# Altium project PWM Controller.PrjPcb
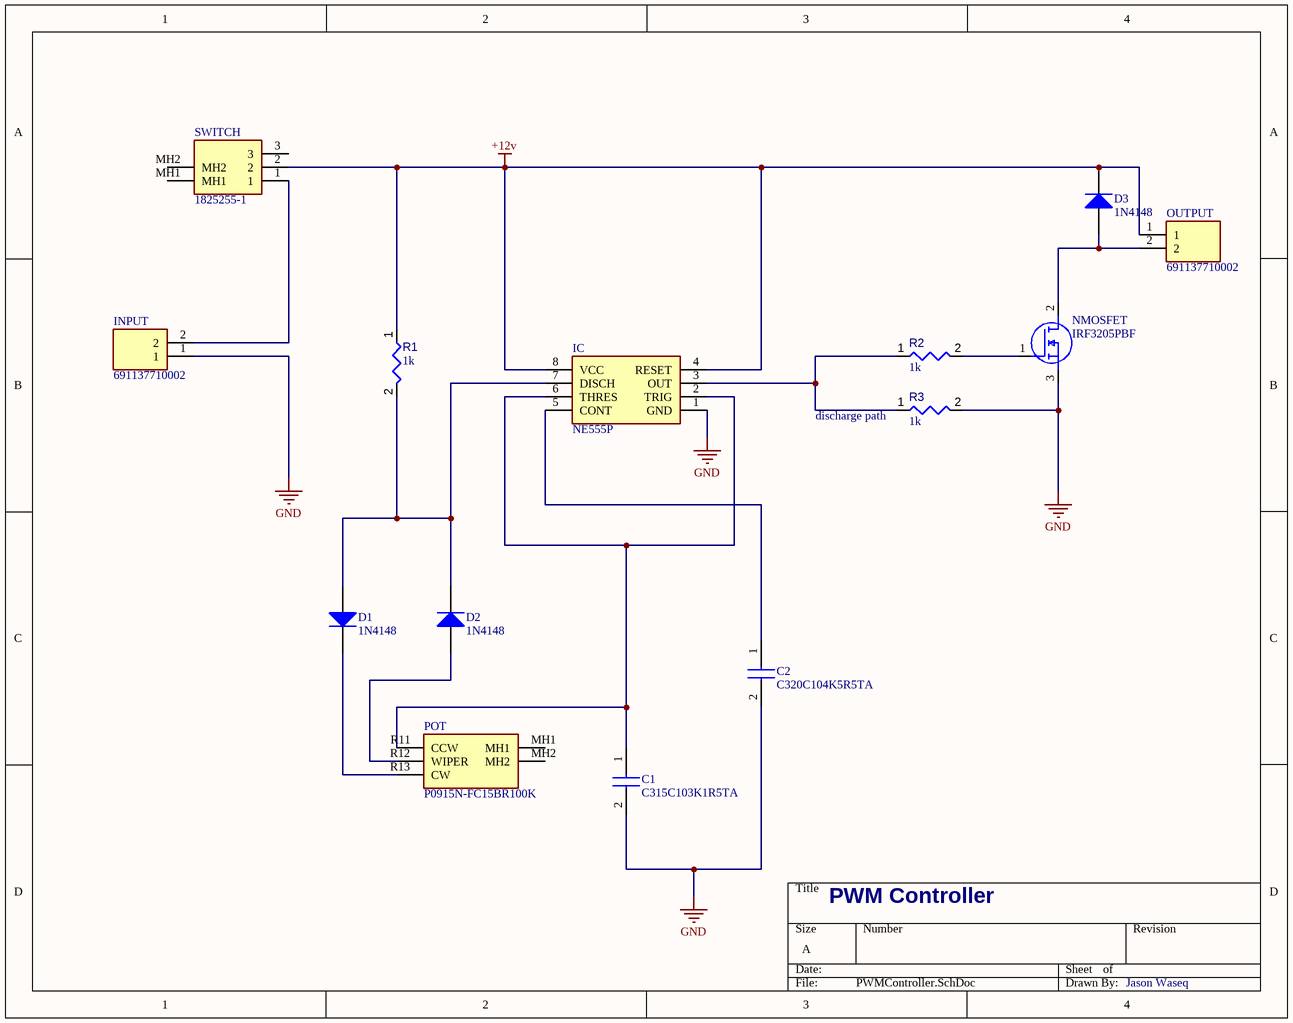
[diagram p0: PWMController.SchDoc]
1 sheet, 14 parts. Net scope: global (net labels, ports and power ports of the same name join across sheets).
Board file: PWMController.PcbDoc

## Sheet PWMController.SchDoc
size A; SheetNumber: 1; SheetTotal: 1; SPICEModelCacheWEVZOAQU: <root> / <DocumentId>WEVZOAQU</DocumentId> / <CacheFrame Number="0"> / <Model Name="555" Kind="CKT"> / <Text>*555 / *Nodes:       GND TRIG OUT RESET CVOLT THOLD DISCHG VCC / .SUBCKT 555    1   2    3    4     5     6     7     8 / EREF 15 1 8 1 .5 / GSOURCE 8 3 8 26 12.5E-3 / GSINK 3 1 26 1 67E-3 / VD1 8 27 DC .8 / VD2 28 1 DC .85 / VREF 30 1 DC 1.2 / C1 29 1 700E-15 / RREF2 30 1 100E3 / RREF 15 1 100E3 / ROUT 3 1 100K / R1 6 1 500E9 / R2 2 1 500E9 / R3 8 5 75E3 / R4 5 9 75E3 / R5 9 1 75E3 / R6 10 11 1E3 / R7 13 14 1E3 / R8 8 12 150E3 / R9 4 8 500E9 / R10 20 19 1E3 / R11 16 17 1E3 / R12 8 18 150E3 / R13 8 21 150E3 / R14 22 23 1E3 / R15 8 26 150E3 / R16 24 25 1E3 / R19 7 1 500E9 / R20 29 26 1E6 / D1 1 11 DMOD / D2 12 11 DMOD / D3 12 14 DMOD / D4 1 14 DMOD / D5 18 17 DMOD / D6 1 17 DMOD / D7 18 19 DMOD / D8 1 19 DMOD / D9 21 14 DMOD / D10 21 25 DMOD / D11 1 23 DMOD / D12 18 23 DMOD / D13 26 25 DMOD / D14 1 25 DMOD1 / D15 3 27 DMOD / D16 28 3 DMOD / E1 10 1 6 5 1000 / E2 13 1 2 9 1000 / E3 16 1 15 12 1000 / E4 22 1 15 21 1000 / E5 24 1 15 18 1000 / E7 20 1 4 30 1000 / M1 7 29 1 1 MOSMOD / .MODEL MOSMOD NMOS (LEVEL=1 KP=1 VTO=1 RD=5) / .MODEL DMOD D (RS=1E-6) / .MODEL DMOD1 D (RS=1E-6 IS=1E-9) / .ENDS 555</Text> / </Model> / <Model Name="nmosfet_level1" Kind="MDL"> / <Text>*----------------------------------------------------------------------------------------------------------------------- / *MOSFETs / *--------------------------------------------------------------------------------------------------------------------- / *MOS1 Shichman and Hodges Models / .model NMOSFET_Level1 nmos (Level=1) </Text> / </Model> / <Model Name="pot" Kind="CKT"> / <Text>*------------------------------------------------------------------------------------------------------------------------- / * potentiometer position must be between 0 and 1 / .SUBCKT POT in out pos params: value=1k  position=0.5 / r1 in pos {value*position} / r2 pos out {value*(1.0-position)} / .ENDS</Text> / </Model> / <Model Name="spst_switch" Kind="CKT"> / <Text>*------------------------- / *SPST Sw Button / * state: if closed&gt;0 - closed else open / * Rclosed -  Closed state resistance / * Ropen -  Open state resistance (Ropen/Rclosed &lt; 1E10) / .SUBCKT  SPST_Switch node1  node2  PARAMS: / + closed=0 / + Rclosed=1m / + Ropen=1Meg / B1 int1 0 V={if(closed&gt;0,1,0)} / S1 node1 node2 int1 0 Smod / .model Smod Vswitch(Ron={Rclosed} Roff={Ropen}) / .ends</Text> / </Model> / </CacheFrame> / </root>

### Parts
C1  C315C103K1R5TA  [C315C103K1R5TA]
C2  C320C104K5R5TA  [C320C104K5R5TA]
D1  1N4148  [NXP-SOD27-2_V]
D2  1N4148  [NXP-SOD27-2_V]
D3  1N4148  [NXP-SOD27-2_V]
IC  NE555P  [DIP794W53P254L959H508Q8N]
INPUT  691137710002  [SHDR2W70P0X500_1X2_1000X750X1160P]
NMOSFET  IRF3205PBF  [TO254P483X1016X1994-3P]
OUTPUT  691137710002  [SHDR2W70P0X500_1X2_1000X750X1160P]
POT  P0915N-FC15BR100K  [P0915NFC15BR100K]
R1  value 1k  [RESA60-630X240]  (hidden comment: MFR-25FBF52-1K)
R2  value 1k  [RESA60-630X240]  (hidden comment: MFR-25FBF52-1K)
R3  value 1k  [RESA60-630X240]  (hidden comment: MFR-25FBF52-1K)
SWITCH  1825255-1  [18252551]

### Nets
+12v: D3.2(K) IC.4(RESET) IC.8(VCC) OUTPUT.1 R1.1 SWITCH.2
GND: C1.2 C2.2 IC.1(GND) INPUT.1 NMOSFET.3(S) R3.2
NetC1_1: C1.1 IC.2(TRIG) IC.6(THRES) POT.R11(CCW)
NetC2_1: C2.1 IC.5(CONT)
NetD1_1: D1.1(A) D2.2(K) IC.7(DISCH) R1.2
NetD1_2: D1.2(K) POT.R13(CW)
NetD2_1: D2.1(A) POT.R12(WIPER)
NetD3_1: D3.1(A) NMOSFET.2(D) OUTPUT.2
NetIC_3: IC.3(OUT) R2.1 R3.1
NetINPUT_2: INPUT.2 SWITCH.1
NetNMOSFET_1: NMOSFET.1(G) R2.2

Not connected (* = marked no-connect by the designer): POT MH1 MH2; SWITCH 3 MH1 MH2

### Notes on the sheet
- (near R3) discharge path
- PWM Controller
- Jason Waseq

### Library data of the parts
C1 = C315C103K1R5TA: Capacitor; Manufacturer_Name: KEMET; Datasheet Link: https://content.kemet.com/datasheets/KEM_C1050_GOLDMAX_X7R.pdf; Height: 5.33mm; Manufacturer_Part_Number: C315C103K1R5TA; Mouser Part Number: 80-C315C103K1R; Mouser Price/Stock: https://www.mouser.co.uk/ProductDetail/KEMET/C315C103K1R5TA?qs=owscpGBW86WnCk7Nx2fiWQ%3D%3D; Arrow Part Number: C315C103K1R5TA; Arrow Price/Stock: https://www.arrow.com/en/products/c315c103k1r5ta/kemet-corporation?region=nac
C2 = C320C104K5R5TA: Capacitor; Manufacturer_Name: KEMET; Datasheet Link: https://content.kemet.com/datasheets/KEM_C1050_GOLDMAX_X7R.pdf; Height: 5.84mm; Manufacturer_Part_Number: C320C104K5R5TA; Mouser Part Number: 80-C320C104K5R; Mouser Price/Stock: https://www.mouser.co.uk/ProductDetail/KEMET/C320C104K5R5TA?qs=PmkNt%2FFLxQc4kNUCHU6a6Q%3D%3D; Arrow Part Number: C320C104K5R5TA; Arrow Price/Stock: https://www.arrow.com/en/products/c320c104k5r5ta/kemet-corporation?utm_currency=USD&region=nac
D1-D3 = CMP-004-00000-2: High Speed Diode, 100 V, 0.45 A, -65 to 175 degC, 2-Pin SOD27, RoHS, Bulk; Manufacturer: Fairchild; Elements: 1; Recovery Time: 4ns; Forward Current: 300mA; Power: 500mW; Forward Voltage: 1V; Max Surge Current: 4A; Peak Reverse Current: 5uA; Datasheet URL: http://www.nxp.com/documents/data_sheet/1N4148_1N4448.pdf; Min Operating Temperature: -65°C; Manufacturer URL: https://www.fairchildsemi.com/; Packaging: Bulk; Diameter: 1.91mm; Pins: 2; Package URL: http://www.nxp.com/documents/data_sheet/1N4148_1N4448.pdf; Package Reference: SOD27; Max Operating Temperature: 175°C; Package Quantity: 2000; Case/Package: DO; Datasheet Version: Aug-04; RoHS Compliant: True
IC = NE555P: Integrated Circuit; Manufacturer_Name: Texas Instruments; Datasheet Link: http://www.ti.com/lit/ds/symlink/ne555.pdf; Height: 5.08mm; Manufacturer_Part_Number: NE555P; Mouser Part Number: 595-NE555P; Mouser Price/Stock: https://www.mouser.co.uk/ProductDetail/Texas-Instruments/NE555P?qs=rkhjVJ6%2F3EIf4CWgjIKuKQ%3D%3D; Arrow Part Number: NE555P; Arrow Price/Stock: https://www.arrow.com/en/products/ne555p/texas-instruments?utm_currency=USD&region=europe
INPUT OUTPUT = 691137710002: Connector; Manufacturer_Name: Wurth Elektronik; Datasheet Link: https://katalog.we-online.com/em/datasheet/691137710002.pdf; Height: 11.6mm; Manufacturer_Part_Number: 691137710002; Mouser Part Number: 710-691137710002; Mouser Price/Stock: https://www.mouser.co.uk/ProductDetail/Wurth-Elektronik/691137710002?qs=lBTPRtX1sU9LnHBbviNKGA%3D%3D
NMOSFET = IRF3205PBF: MOSFET (N-Channel); Manufacturer_Name: Infineon; Datasheet Link: https://componentsearchengine.com/Datasheets/2/IRF3205PBF.pdf; Height: 4.83mm; Manufacturer_Part_Number: IRF3205PBF; Mouser Part Number: 942-IRF3205PBF; Mouser Price/Stock: https://www.mouser.co.uk/ProductDetail/Infineon-Technologies/IRF3205PBF?qs=2r01AXMCG3Ng8ivZ6KPoqw%3D%3D; Arrow Part Number: IRF3205PBF; Arrow Price/Stock: https://www.arrow.com/en/products/irf3205pbf/infineon-technologies-ag?utm_currency=USD&region=europe
POT = P0915N-FC15BR100K: Variable Resistor; Manufacturer_Name: TT Electronics; Datasheet Link: https://www.digikey.ph/en/products/detail/tt-electronics-bi/P0915N-FC15BR100K/5957453; Height: 26mm; Manufacturer_Part_Number: P0915N-FC15BR100K; Mouser Part Number: 858-P0915NFC15BR100K; Mouser Price/Stock: https://www.mouser.co.uk/ProductDetail/BI-Technologies-TT-Electronics/P0915N-FC15BR100K?qs=56eeD6vBg8hdp2JeLzjkVQ%3D%3D; Arrow Part Number: P0915N-FC15BR100K; Arrow Price/Stock: null?region=nac
R1-R3 = CMP-009-00048-4: Axial Resistor, 1 KOhm, +/- 1%, 250 mW, -55 to 155 degC, 2-Pin THD, RoHS, Bulk; Manufacturer: Yageo; Voltage Rating: 250V; Power: 250mW; Min Operating Temperature: -55°C; Max Operating Temperature: 155°C; Tolerance: 1%; Package Reference: MFR-25; Composition: CarbonFilm; Mounting Technology: TH; Packaging: Bulk; Case/Package: Axial; Datasheet URL: http://www.yageo.com/documents/recent/Yageo%20LR_MFR_2013.pdf; Package Quantity: 200; Manufacturer URL: http://www.yageo.com/; Package Description: 2-Pin Axial Lead, Dia 2.4 mm, Body Length 6.3 mm; Datasheet Version: Apr-13; RoHS Compliant: True
SWITCH = 1825255-1: Switch; Manufacturer_Name: TE Connectivity; Datasheet Link: https://www.te.com/commerce/DocumentDelivery/DDEController?Action=srchrtrv&DocNm=1308111-1_SWITCHES_CORE_PROGRAM_CATALOG&DocType=Catalog%20Section&DocLang=English&PartCntxt=1825255-1&DocFormat=pdf; Height: 12.3mm; Manufacturer_Part_Number: 1825255-1; Arrow Part Number: 1825255-1; Arrow Price/Stock: https://www.arrow.com/en/products/1825255-1/te-connectivity?utm_currency=USD&region=nac